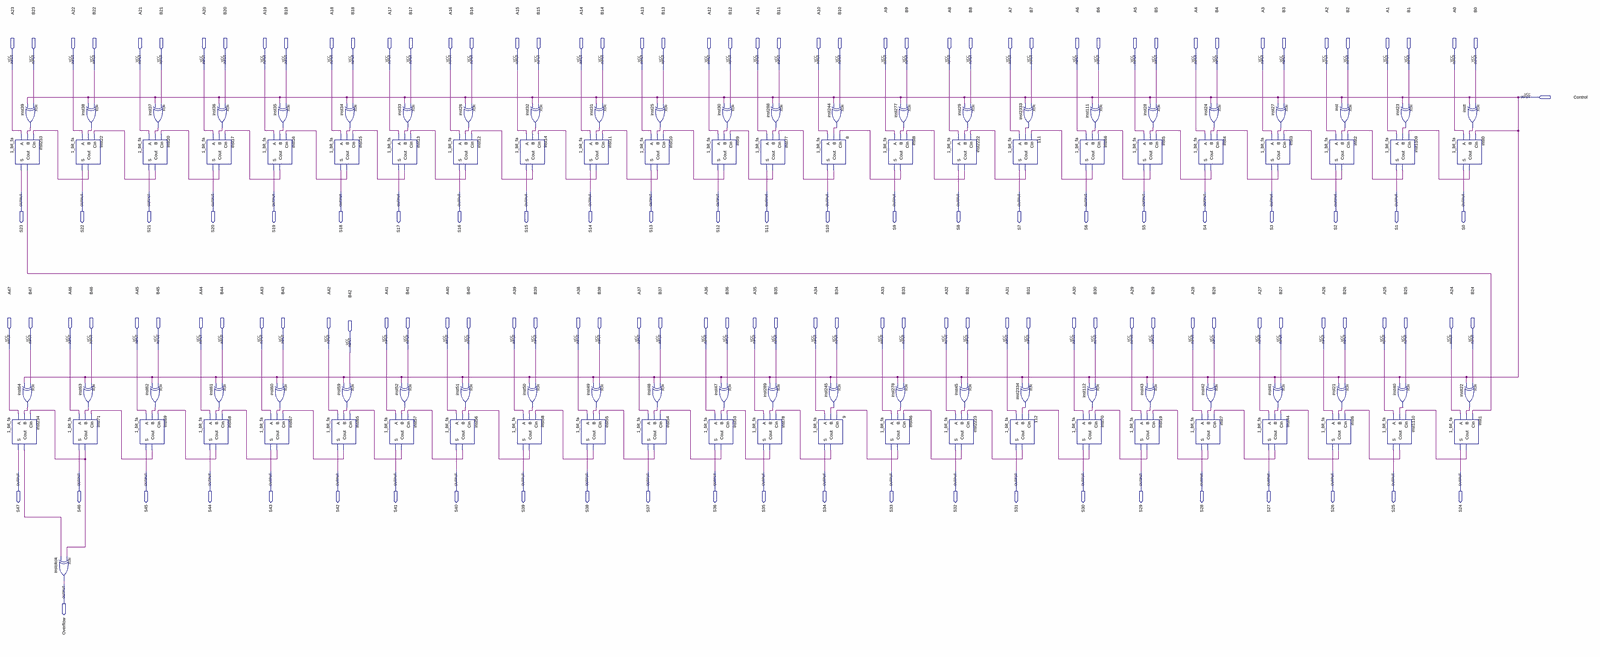
[diagram p0: schematic sheet, whole]
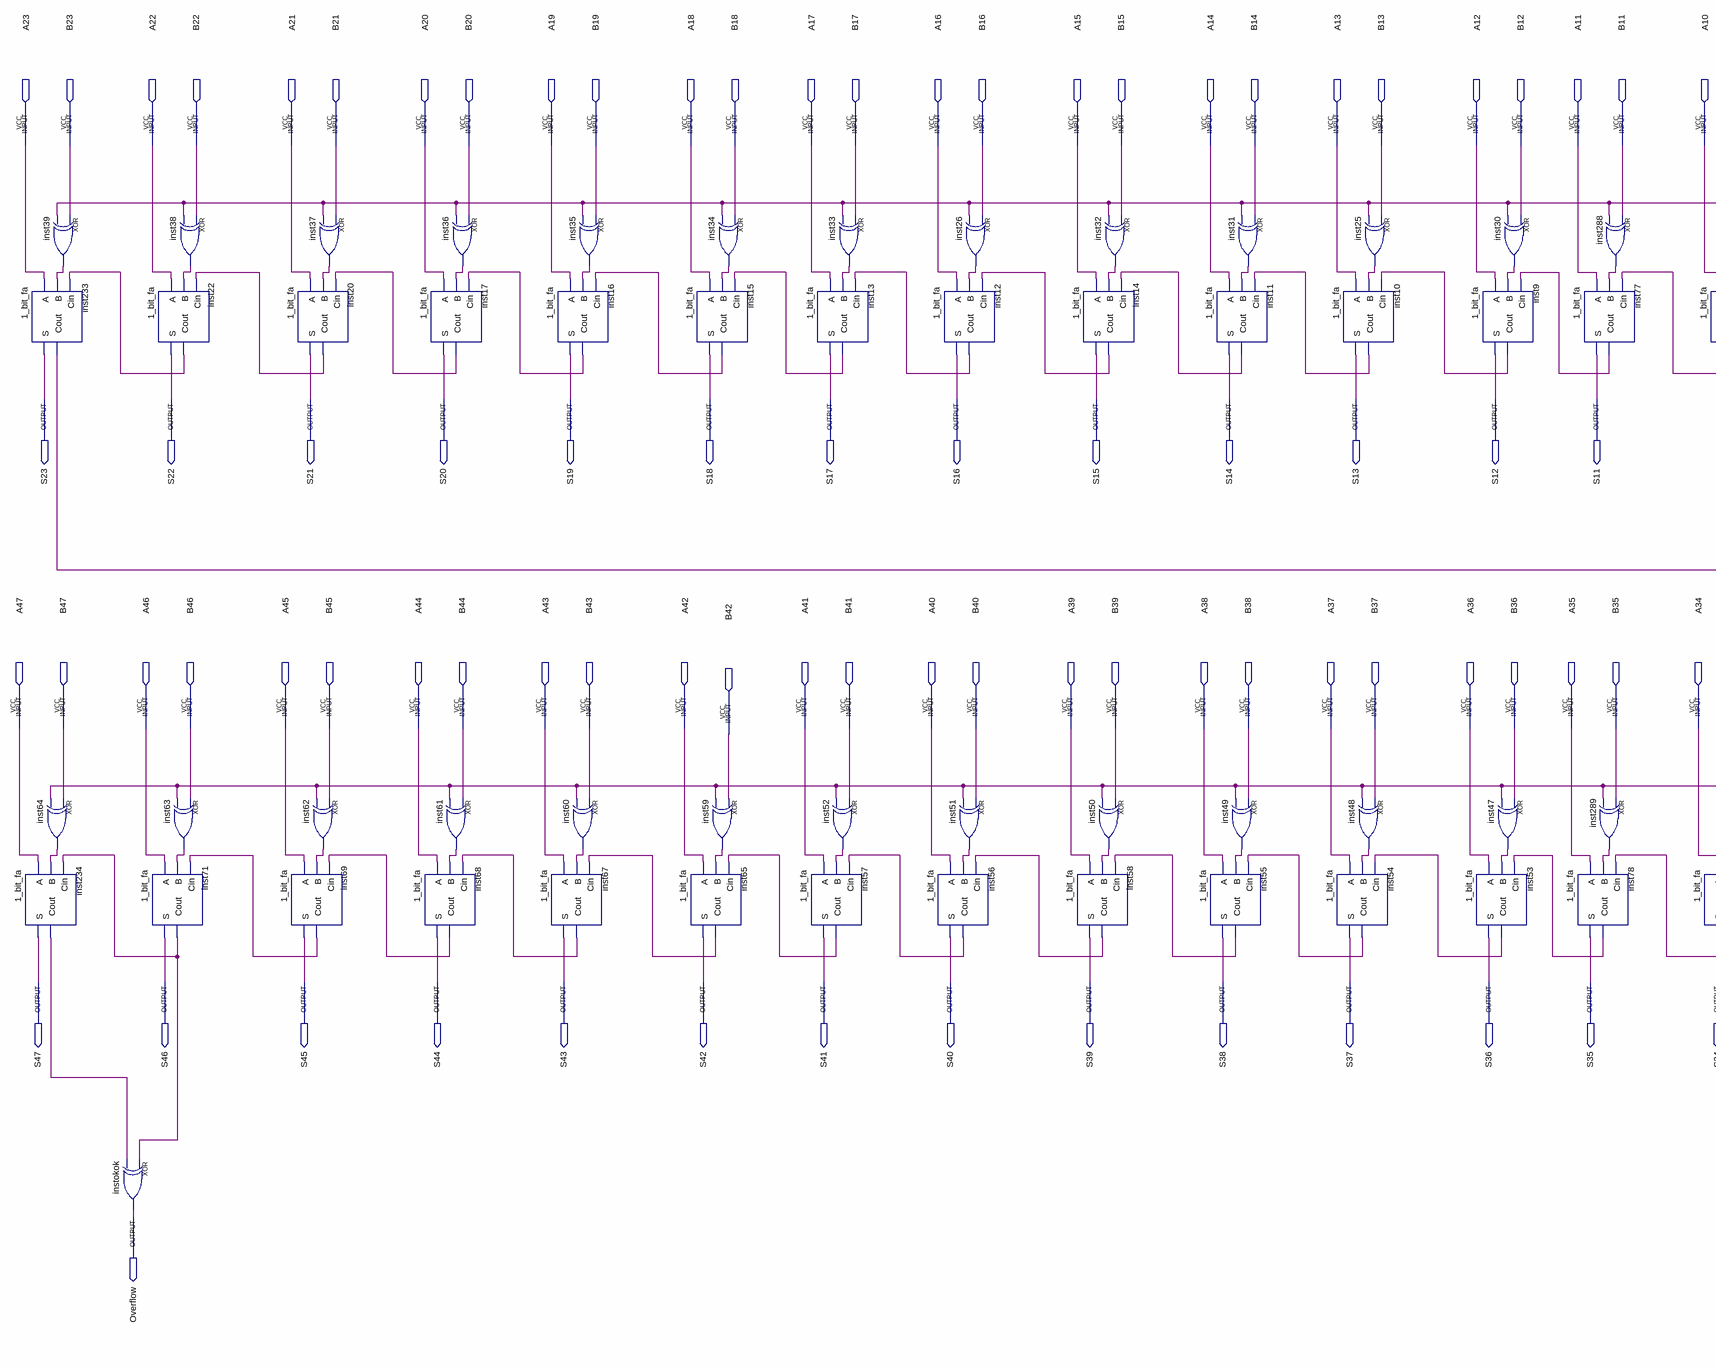
[diagram p1: schematic sheet, left part]
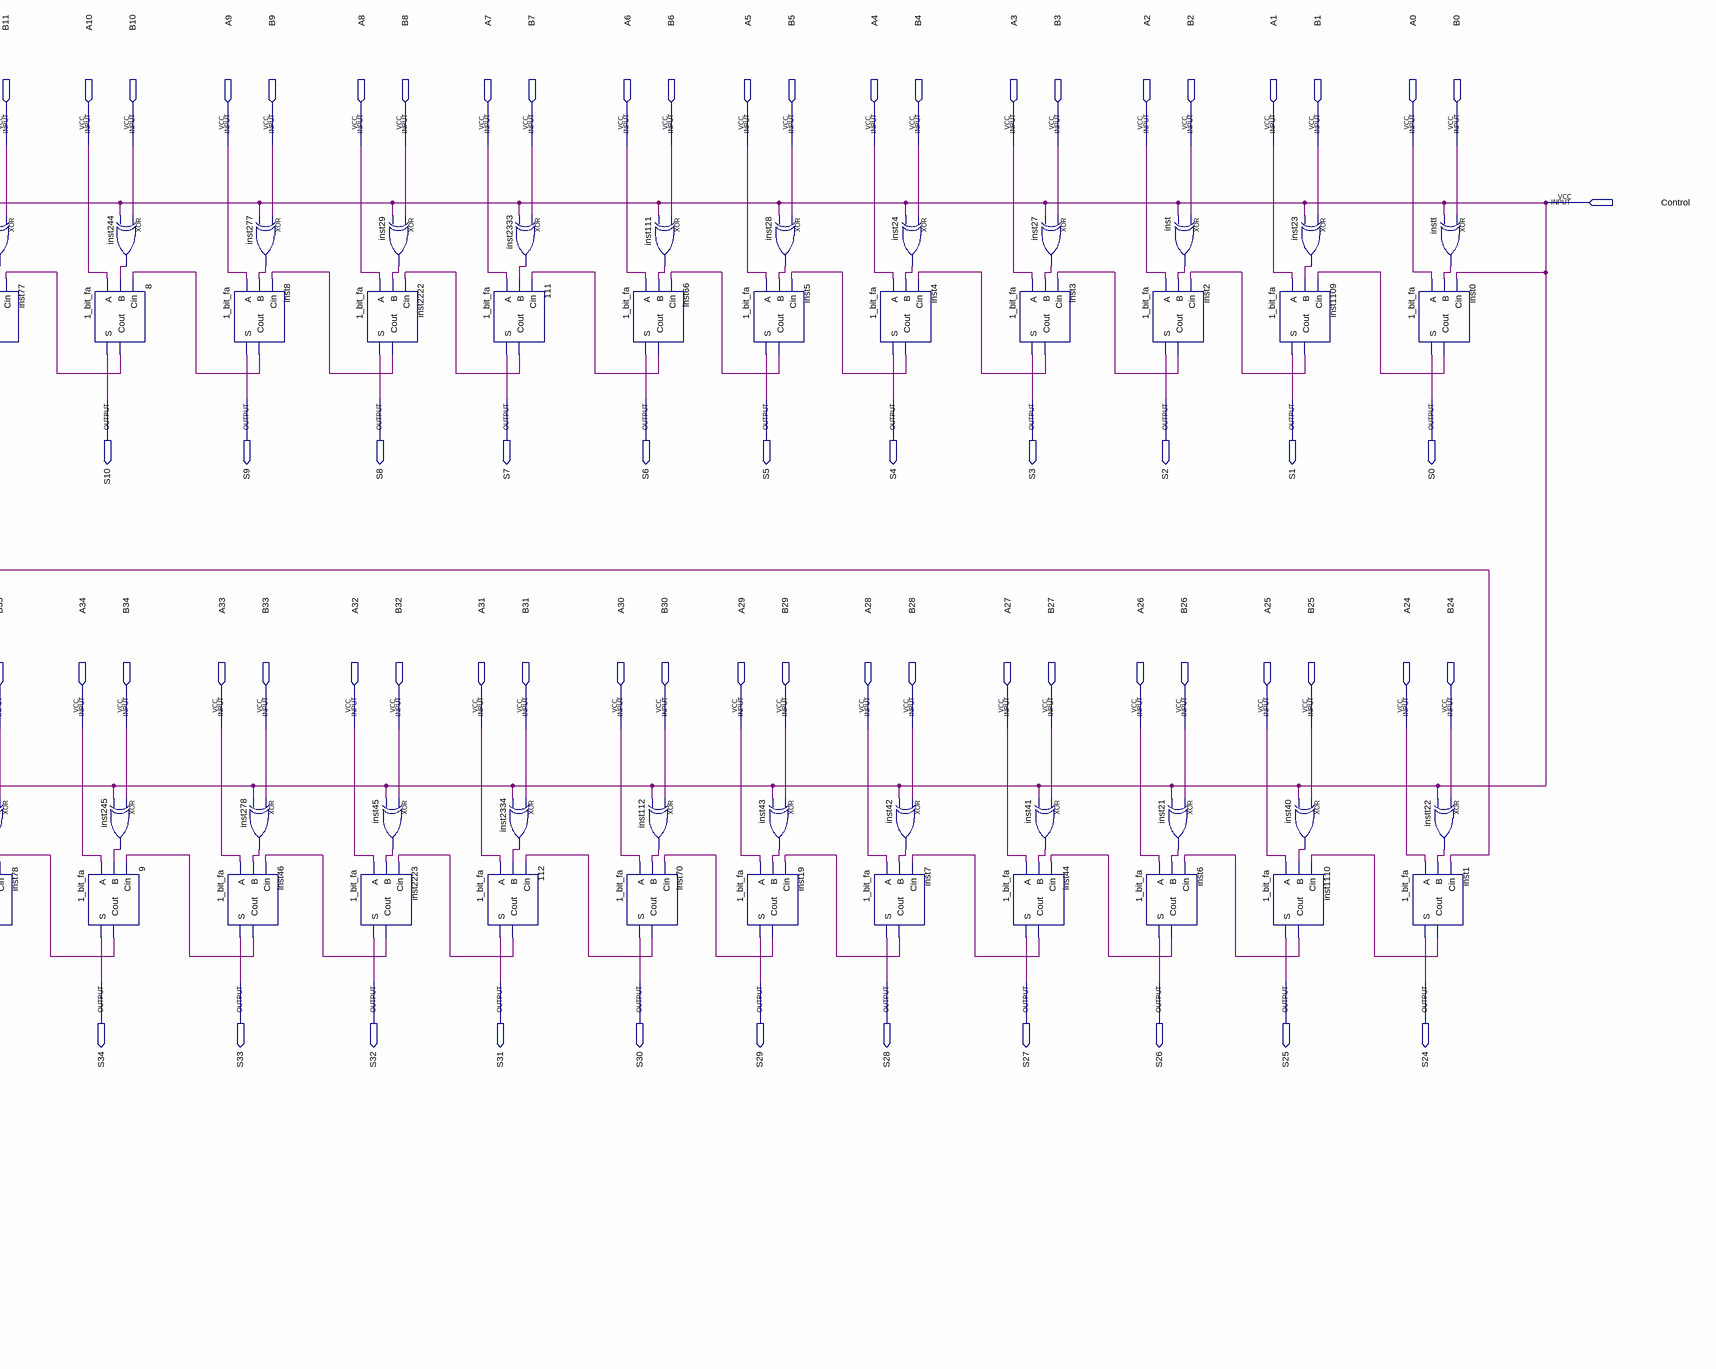
[diagram p2: schematic sheet, right part]
// Quartus schematic 48_bit_add_sub.bdf as structural Verilog: 97 symbols, 146 pins
module \48_bit_add_sub  (
  input  A23,
  input  B23,
  input  A22,
  input  B22,
  input  A21,
  input  B21,
  input  A20,
  input  B20,
  input  A19,
  input  B19,
  input  A18,
  input  B18,
  input  A17,
  input  B17,
  input  A16,
  input  B16,
  input  A15,
  input  B15,
  input  A14,
  input  B14,
  input  A13,
  input  B13,
  input  A12,
  input  B12,
  input  A11,
  input  B11,
  input  A10,
  input  B10,
  input  A9,
  input  B9,
  input  A8,
  input  B8,
  input  A7,
  input  B7,
  input  A6,
  input  B6,
  input  A5,
  input  B5,
  input  A4,
  input  B4,
  input  A3,
  input  B3,
  input  A2,
  input  B2,
  input  A1,
  input  B1,
  input  A0,
  input  B0,
  input  Control,
  input  A47,
  input  B47,
  input  A46,
  input  B46,
  input  A45,
  input  B45,
  input  A44,
  input  B44,
  input  A43,
  input  B43,
  input  A42,
  input  A41,
  input  B41,
  input  A40,
  input  B40,
  input  A39,
  input  B39,
  input  A38,
  input  B38,
  input  A37,
  input  B37,
  input  A36,
  input  B36,
  input  A35,
  input  B35,
  input  A34,
  input  B34,
  input  A33,
  input  B33,
  input  A32,
  input  B32,
  input  A31,
  input  B31,
  input  A30,
  input  B30,
  input  A29,
  input  B29,
  input  A28,
  input  B28,
  input  A27,
  input  B27,
  input  A26,
  input  B26,
  input  A25,
  input  B25,
  input  A24,
  input  B24,
  input  B42,
  output S23,
  output S22,
  output S21,
  output S20,
  output S19,
  output S18,
  output S17,
  output S16,
  output S15,
  output S14,
  output S13,
  output S12,
  output S11,
  output S10,
  output S9,
  output S8,
  output S7,
  output S6,
  output S5,
  output S4,
  output S3,
  output S2,
  output S1,
  output S0,
  output S47,
  output S46,
  output S45,
  output S44,
  output S43,
  output S42,
  output S41,
  output S40,
  output S39,
  output S38,
  output S37,
  output S36,
  output S35,
  output S34,
  output S33,
  output S32,
  output S31,
  output S30,
  output S29,
  output S28,
  output S27,
  output S26,
  output S25,
  output S24,
  output Overflow
);

  wire inst0_cout, inst1_cout, inst2_cout, inst3_cout, inst4_cout, inst5_cout, inst6_cout, inst7_cout,
       inst8_cout, inst9_cout, inst10_cout, inst11_cout, inst12_cout, inst13_cout, inst14_cout, inst15_cout,
       inst16_cout, inst17_cout, inst19_cout, inst20_cout, inst21_out, inst22_cout, inst23_out, inst24_out,
       inst25_out, inst26_out, inst27_out, inst28_out, inst29_out, inst30_out, inst31_out, inst32_out,
       inst33_out, inst34_out, inst35_out, inst36_out, inst37_out, inst38_out, inst39_out, inst40_out,
       inst41_out, inst42_out, inst43_out, inst44_cout, inst45_out, inst46_cout, inst47_out, inst48_out,
       inst49_out, inst50_out, inst51_out, inst52_out, inst53_cout, inst54_cout, inst55_cout, inst56_cout,
       inst57_cout, inst58_cout, inst59_out, inst60_out, inst61_out, inst62_out, inst63_out, inst64_out,
       inst65_cout, inst66_cout, inst67_cout, inst68_cout, inst69_cout, inst70_cout, inst71_cout,
       inst77_cout, inst78_cout, inst111_out, inst112_out, inst233_cout, inst234_cout, inst244_out,
       inst245_out, inst277_out, inst278_out, inst288_out, inst289_out, inst1109_cout, inst1110_cout,
       inst2222_cout, inst2223_cout, inst2333_out, inst2334_out, inst_out, instt22_out, instt_out, n8_cout,
       n9_cout, n111_cout, n112_cout;

  xor inst39 (inst39_out, B23, Control);
  \1_bit_fa  inst233 (.A(A23), .B(inst39_out), .Cin(inst22_cout), .S(S23), .Cout(inst233_cout));
  xor inst64 (inst64_out, B47, Control);
  \1_bit_fa  inst234 (.A(A47), .B(inst64_out), .Cin(inst71_cout), .S(S47), .Cout(inst234_cout));
  \1_bit_fa  inst22 (.A(A22), .B(inst38_out), .Cin(inst20_cout), .S(S22), .Cout(inst22_cout));
  \1_bit_fa  inst71 (.A(A46), .B(inst63_out), .Cin(inst69_cout), .S(S46), .Cout(inst71_cout));
  xor instokok (Overflow, inst71_cout, inst234_cout);
  xor inst38 (inst38_out, B22, Control);
  xor inst63 (inst63_out, B46, Control);
  xor inst37 (inst37_out, B21, Control);
  \1_bit_fa  inst20 (.A(A21), .B(inst37_out), .Cin(inst17_cout), .S(S21), .Cout(inst20_cout));
  xor inst62 (inst62_out, B45, Control);
  \1_bit_fa  inst69 (.A(A45), .B(inst62_out), .Cin(inst68_cout), .S(S45), .Cout(inst69_cout));
  \1_bit_fa  inst68 (.A(A44), .B(inst61_out), .Cin(inst67_cout), .S(S44), .Cout(inst68_cout));
  xor inst36 (inst36_out, B20, Control);
  \1_bit_fa  inst17 (.A(A20), .B(inst36_out), .Cin(inst16_cout), .S(S20), .Cout(inst17_cout));
  xor inst61 (inst61_out, B44, Control);
  \1_bit_fa  inst16 (.A(A19), .B(inst35_out), .Cin(inst15_cout), .S(S19), .Cout(inst16_cout));
  xor inst60 (inst60_out, B43, Control);
  \1_bit_fa  inst67 (.A(A43), .B(inst60_out), .Cin(inst65_cout), .S(S43), .Cout(inst67_cout));
  xor inst35 (inst35_out, B19, Control);
  xor inst34 (inst34_out, B18, Control);
  \1_bit_fa  inst15 (.A(A18), .B(inst34_out), .Cin(inst13_cout), .S(S18), .Cout(inst15_cout));
  xor inst59 (inst59_out, B42, Control);
  \1_bit_fa  inst65 (.A(A42), .B(inst59_out), .Cin(inst57_cout), .S(S42), .Cout(inst65_cout));
  \1_bit_fa  inst13 (.A(A17), .B(inst33_out), .Cin(inst12_cout), .S(S17), .Cout(inst13_cout));
  \1_bit_fa  inst57 (.A(A41), .B(inst52_out), .Cin(inst56_cout), .S(S41), .Cout(inst57_cout));
  xor inst33 (inst33_out, B17, Control);
  xor inst52 (inst52_out, B41, Control);
  xor inst26 (inst26_out, B16, Control);
  \1_bit_fa  inst12 (.A(A16), .B(inst26_out), .Cin(inst14_cout), .S(S16), .Cout(inst12_cout));
  xor inst51 (inst51_out, B40, Control);
  \1_bit_fa  inst56 (.A(A40), .B(inst51_out), .Cin(inst58_cout), .S(S40), .Cout(inst56_cout));
  \1_bit_fa  inst14 (.A(A15), .B(inst32_out), .Cin(inst11_cout), .S(S15), .Cout(inst14_cout));
  \1_bit_fa  inst58 (.A(A39), .B(inst50_out), .Cin(inst55_cout), .S(S39), .Cout(inst58_cout));
  xor inst32 (inst32_out, B15, Control);
  xor inst50 (inst50_out, B39, Control);
  \1_bit_fa  inst11 (.A(A14), .B(inst31_out), .Cin(inst10_cout), .S(S14), .Cout(inst11_cout));
  xor inst49 (inst49_out, B38, Control);
  \1_bit_fa  inst55 (.A(A38), .B(inst49_out), .Cin(inst54_cout), .S(S38), .Cout(inst55_cout));
  xor inst31 (inst31_out, B14, Control);
  \1_bit_fa  inst54 (.A(A37), .B(inst48_out), .Cin(inst53_cout), .S(S37), .Cout(inst54_cout));
  xor inst25 (inst25_out, B13, Control);
  \1_bit_fa  inst10 (.A(A13), .B(inst25_out), .Cin(inst9_cout), .S(S13), .Cout(inst10_cout));
  xor inst48 (inst48_out, B37, Control);
  \1_bit_fa  inst9 (.A(A12), .B(inst30_out), .Cin(inst77_cout), .S(S12), .Cout(inst9_cout));
  \1_bit_fa  inst53 (.A(A36), .B(inst47_out), .Cin(inst78_cout), .S(S36), .Cout(inst53_cout));
  xor inst30 (inst30_out, B12, Control);
  xor inst47 (inst47_out, B36, Control);
  \1_bit_fa  inst77 (.A(A11), .B(inst288_out), .Cin(n8_cout), .S(S11), .Cout(inst77_cout));
  \1_bit_fa  inst78 (.A(A35), .B(inst289_out), .Cin(n9_cout), .S(S35), .Cout(inst78_cout));
  xor inst288 (inst288_out, B11, Control);
  xor inst289 (inst289_out, B35, Control);
  xor inst244 (inst244_out, B10, Control);
  \1_bit_fa  u_8 (.A(A10), .B(inst244_out), .Cin(inst8_cout), .S(S10), .Cout(n8_cout));
  xor inst245 (inst245_out, B34, Control);
  \1_bit_fa  u_9 (.A(A34), .B(inst245_out), .Cin(inst46_cout), .S(S34), .Cout(n9_cout));
  \1_bit_fa  inst46 (.A(A33), .B(inst278_out), .Cin(inst2223_cout), .S(S33), .Cout(inst46_cout));
  xor inst277 (inst277_out, B9, Control);
  \1_bit_fa  inst8 (.A(A9), .B(inst277_out), .Cin(inst2222_cout), .S(S9), .Cout(inst8_cout));
  xor inst278 (inst278_out, B33, Control);
  \1_bit_fa  inst2222 (.A(A8), .B(inst29_out), .Cin(n111_cout), .S(S8), .Cout(inst2222_cout));
  \1_bit_fa  inst2223 (.A(A32), .B(inst45_out), .Cin(n112_cout), .S(S32), .Cout(inst2223_cout));
  xor inst29 (inst29_out, B8, Control);
  xor inst45 (inst45_out, B32, Control);
  xor inst2333 (inst2333_out, B7, Control);
  \1_bit_fa  u_111 (.A(A7), .B(inst2333_out), .Cin(inst66_cout), .S(S7), .Cout(n111_cout));
  xor inst2334 (inst2334_out, B31, Control);
  \1_bit_fa  u_112 (.A(A31), .B(inst2334_out), .Cin(inst70_cout), .S(S31), .Cout(n112_cout));
  \1_bit_fa  inst66 (.A(A6), .B(inst111_out), .Cin(inst5_cout), .S(S6), .Cout(inst66_cout));
  \1_bit_fa  inst70 (.A(A30), .B(inst112_out), .Cin(inst19_cout), .S(S30), .Cout(inst70_cout));
  xor inst111 (inst111_out, B6, Control);
  xor inst112 (inst112_out, B30, Control);
  xor inst28 (inst28_out, B5, Control);
  \1_bit_fa  inst5 (.A(A5), .B(inst28_out), .Cin(inst4_cout), .S(S5), .Cout(inst5_cout));
  xor inst43 (inst43_out, B29, Control);
  \1_bit_fa  inst19 (.A(A29), .B(inst43_out), .Cin(inst7_cout), .S(S29), .Cout(inst19_cout));
  \1_bit_fa  inst4 (.A(A4), .B(inst24_out), .Cin(inst3_cout), .S(S4), .Cout(inst4_cout));
  \1_bit_fa  inst7 (.A(A28), .B(inst42_out), .Cin(inst44_cout), .S(S28), .Cout(inst7_cout));
  xor inst24 (inst24_out, B4, Control);
  xor inst42 (inst42_out, B28, Control);
  \1_bit_fa  inst3 (.A(A3), .B(inst27_out), .Cin(inst2_cout), .S(S3), .Cout(inst3_cout));
  xor inst41 (inst41_out, B27, Control);
  \1_bit_fa  inst44 (.A(A27), .B(inst41_out), .Cin(inst6_cout), .S(S27), .Cout(inst44_cout));
  xor inst27 (inst27_out, B3, Control);
  xor inst (inst_out, B2, Control);
  \1_bit_fa  inst2 (.A(A2), .B(inst_out), .Cin(inst1109_cout), .S(S2), .Cout(inst2_cout));
  xor inst21 (inst21_out, B26, Control);
  \1_bit_fa  inst6 (.A(A26), .B(inst21_out), .Cin(inst1110_cout), .S(S26), .Cout(inst6_cout));
  \1_bit_fa  inst1109 (.A(A1), .B(inst23_out), .Cin(inst0_cout), .S(S1), .Cout(inst1109_cout));
  \1_bit_fa  inst1110 (.A(A25), .B(inst40_out), .Cin(inst1_cout), .S(S25), .Cout(inst1110_cout));
  xor inst23 (inst23_out, B1, Control);
  xor inst40 (inst40_out, B25, Control);
  xor instt (instt_out, B0, Control);
  \1_bit_fa  inst0 (.A(A0), .B(instt_out), .Cin(Control), .S(S0), .Cout(inst0_cout));
  xor instt22 (instt22_out, B24, Control);
  \1_bit_fa  inst1 (.A(A24), .B(instt22_out), .Cin(inst233_cout), .S(S24), .Cout(inst1_cout));
endmodule
